# Altium schematic sheet Relay.SchDoc
size Letter; DocumentNumber: 5; SheetNumber: 5; SheetTotal: 7
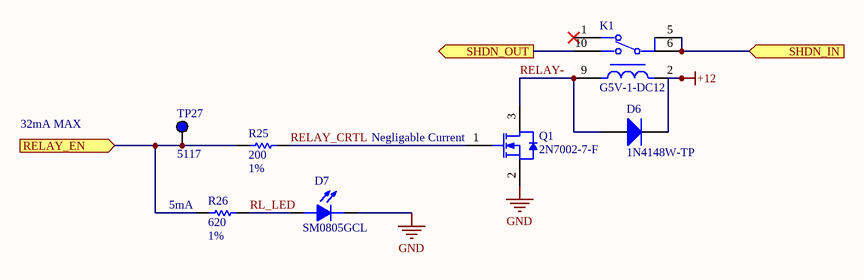
[diagram p0: Relay.SchDoc]

## Parts
D6  1N4148W-TP  [MCC-SOD123_V]
D7  SM0805GCL  [LEDC2012X135N_SM0805GCL(Primary)]
K1  G5V-1-DC12  [Omron_G5V-1-DC12_MFG]
Q1  2N7002-7-F  [DIOD-SOT23-3_V]
R25  Val: 200  Tol: 1%  [0603_RES]  (hidden comment: RES 0603 200 1%)
R26  Val: 620  Tol: 1%  [0603_RES]  (hidden comment: RES 0603 620 1%)
TP27  5117  [KSTN-5117]

## Ports
RELAY_EN (in), SHDN_IN (in), SHDN_OUT (out)

## Nets
+12: D6.2(K) K1.2
GND: D7.C Q1.2(S)
RELAY-: D6.1(A) K1.9 Q1.3(D)
RELAY_CRTL: Q1.1(G) R25.2
RELAY_EN: R25.1 R26.1 TP27.1 ; port RELAY_EN
RL_LED: D7.A R26.2
SHDN_IN: K1.5 K1.6 ; port SHDN_IN
SHDN_OUT: K1.10 ; port SHDN_OUT

Not connected (* = marked no-connect by the designer): K1 1*

## Notes on the sheet
- 32mA MAX
- (near Q1) Negligable Current
- (near R26) 5mA
- Title:
- Size:
- Date:
- Desc:
- Letter
- Auth:
- Sheet
- Proj:
- of
- www.uvmaero.org
- File:

## Library data of the parts
D6 = CMP-2000-04993-1: High Speed Switching Diode, 400 mW, 150 mA, -65 to 150 degC, 2-Pin SOD123, RoHS, Tape and Reel; Manufacturer: Micro Commercial Components; Reverse Recovery Time-Max: 4ns; Average Forward Current-Max: 0.15A; Peak Current-Max: 2A; Power Dissipation: 400mW; Reverse Voltage-Max [Vrrm]: 100V; Datasheet URL: https://datasheet.ciiva.com/16836/1n4148wsod123-16836277.pdf; Package Reference: SOD123; Package URL: http://www.mccsemi.com/up_pdf/1N4448W(SOD-123).pdf; Package Description: 2-Pin Small Outline Diode, Body 2.7 x 1.6 mm, Height 1.35 mm; Manufacturer URL: http://www.mccsemi.com/; Datasheet Version: Rev. C, 07/2014
D7 = SM0805GCL: Green 574nm LED Indication - Discrete 1.9V 0805 (2012 Metric); Supplier 1: Digi-Key; Supplier Part Number 1: 492-2525-1-ND
K1 = G5V-1-DC12: General Purpose Relay SPDT (1 Form C) Through Hole; Manufacturer: Omron; Coil Current: 12.5mA; Coil Power: 150mW; Coil Resistance: 960Ω; Coil Type: Non-Latching; Current Rating: 2A; Number Of Contacts: 1; Standoff Height: 0.5mm; Switching Current: 1A; Verification Version: 0.0.0.1; Datasheet Path: datasheets/Relay_Omron_G5V-1-DC12_eec.pdf; Ambient Temperature Range High: +70°C; Ambient Temperature Range Low: -40°C; Automotive: No; ComponentLink1Description: Upverter; ComponentLink1URL: https://upverter.com/upn/revision/60c0f3c9560d0c93/; ComponentLink2Description: Datasheet; ComponentLink2URL: https://omronfs.omron.com/en_US/ecb/products/pdf/en-g5v_1.pdf; Digikey Description: RELAY GEN PURPOSE SPDT 1A 125V; Digikey Part Number: Z774-ND; Height: 10mm; Lead Free: Yes; Mouser Description: Relay; E-Mech; Low Signal; SPDT; Cur-Rtg 1A; Ctrl-V 12DC; Vol-Rtg 125/60AC/DC; PCB Mnt; Mouser Part Number: 653-G5V-1-DC12; Package: G5V-1-DC12; Part Number: G5V-1-DC12; Price: 1.48127132607; RoHS: TRUE; Supplier 1: Digi-Key; Supplier 2: Mouser; Supplier Part Number 1: Z774-ND; Supplier Part Number 2: 653-G5V-1-DC12; Temperature: -40°C to +70°C; Temperature Range High: +70°C; Temperature Range Low: -40°C; Throw Configuration: SPDT; helpURL: https://upverter.com/upn/revision/60c0f3c9560d0c93/
Q1 = CMP-2000-04929-1: N-Channel Enhancement Mode Field Effect Transistor, 60 V, 0.115 A, -55 to 150 degC, 3-Pin SOT23, RoHS, Tape and Reel; Id - Continuous Drain Current: 115mA; Typical Turn-On Delay Time: 7ns; Typical Turn-Off Delay Time: 11ns; Brand: DiodesIncorporated; Transistor Type: 1N-Channel; Vgs - Gate-Source Voltage: 20V; Rise Time: 3ns; Configuration: Single; Fall Time: 5.6ns; Vds - Drain-Source Breakdown Voltage: 70V; Rds On - Drain-Source Resistance: 7.5Ohms; Number of Channels: 1Channel; Forward Transconductance - Min: 0.08S; Pd - Power Dissipation: 300mW; Unit Weight: 0.000282oz; Datasheet URL: http://datasheet.octopart.com/2N7002-7-F-Diodes-Inc.-datasheet-8326113.pdf; Width: 1.3mm; Series: 2N7002; Length: 2.9mm; Product Category: MOSFET; Minimum Operating Temperature: -55C; Manufacturer URL: http://www.diodes.com/; Mounting Style: SMD/SMT; Package Reference: SOT23-3; Package Description: 3-Pin Small Outline Transistor, Body 2.9 x 1.3 mm, Pitch 0.96 mm; Maximum Operating Temperature: +150C; Transistor Polarity: N-Channel; Factory Pack Quantity: 3000; Technology: Si; Channel Mode: Enhancement; Datasheet Version: Rev. 21-2, 02/2009; Type: EnhancementModeFieldEffectTransistor; RoHS: True; Packaging: Reel; Package / Case: SOT-23-3; Height: 1mm; Product: MOSFETSmallSignal; Manufacturer: DiodesIncorporated
R25 = RES 0603 200 1%: Resistor Surface Mount, 200 Ohms, 0603 Footprint, 1% Tolerance 0.1W; Manufacturer: Various; PCB Package: 0603; Description in Visual: Res SMT 200 0603  1%  0.1W; Value: 200; P/N: RES 0603 200 1%; Manufacturer P/N: Various; Power_Rating: 0.1W; Tolerance: 1%
R26 = RES 0603 620 1%: Resistor Surface Mount, 620 Ohms, 0603 Footprint, 1% Tolerance 0.1W; Manufacturer: Various; PCB Package: 0603; Description in Visual: Res SMT 620 0603  1%  0.1W; Value: 620; P/N: RES 0603 620 1%; Manufacturer P/N: Various; Power_Rating: 0.1W; Tolerance: 1%
TP27 = 5117: Test Point, Blue, 1-Pin THD, RoHS, Bulk; Manufacturer: KeystoneElectronics; Outside Diameter: 2.54mm; Plating: Silver; Mounting Hole Size: 1mm; Product: TestPoints; Packaging: Bulk; Manufacturer URL: http://www.keyelco.com/; Length: 7.62mm; Datasheet Version: Rev. G, 12/2008; Type: Miniature; Product Category: CircuitBoardHardware-PCB; Material: Nylon; RoHS: True; Contact Material: PhosphorBronze; Datasheet URL: https://ciiva.com/datasheet-click-2917627?src=ciiva&sig=bd195616; Color: Blue; Brand: KeystoneElectronics; Supplier 1: Digi-Key; Supplier Part Number 1: 36-5117-ND